# EAGLE design pdivider (EAGLE 9.6.2)
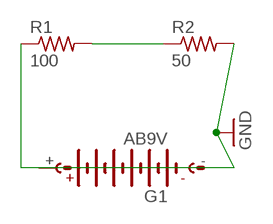
[diagram p0: schematic, sheet 1]

## Parts
G1  AB9V  [AB9V]
R1  100  R-US_R0603  [R0603]
R2  50  R-US_R0603  [R0603]

## Nets
GND: G1.+ R2.2
N$1: G1.- R1.1
N$2: R1.2 R2.1

## Library data of the parts
G1 = battery:AB9V: 9-V BATTERY CLIP
R1 R2 = rcl:R-US_: RESISTOR, American symbol; SPICEPREFIX: R

## Board
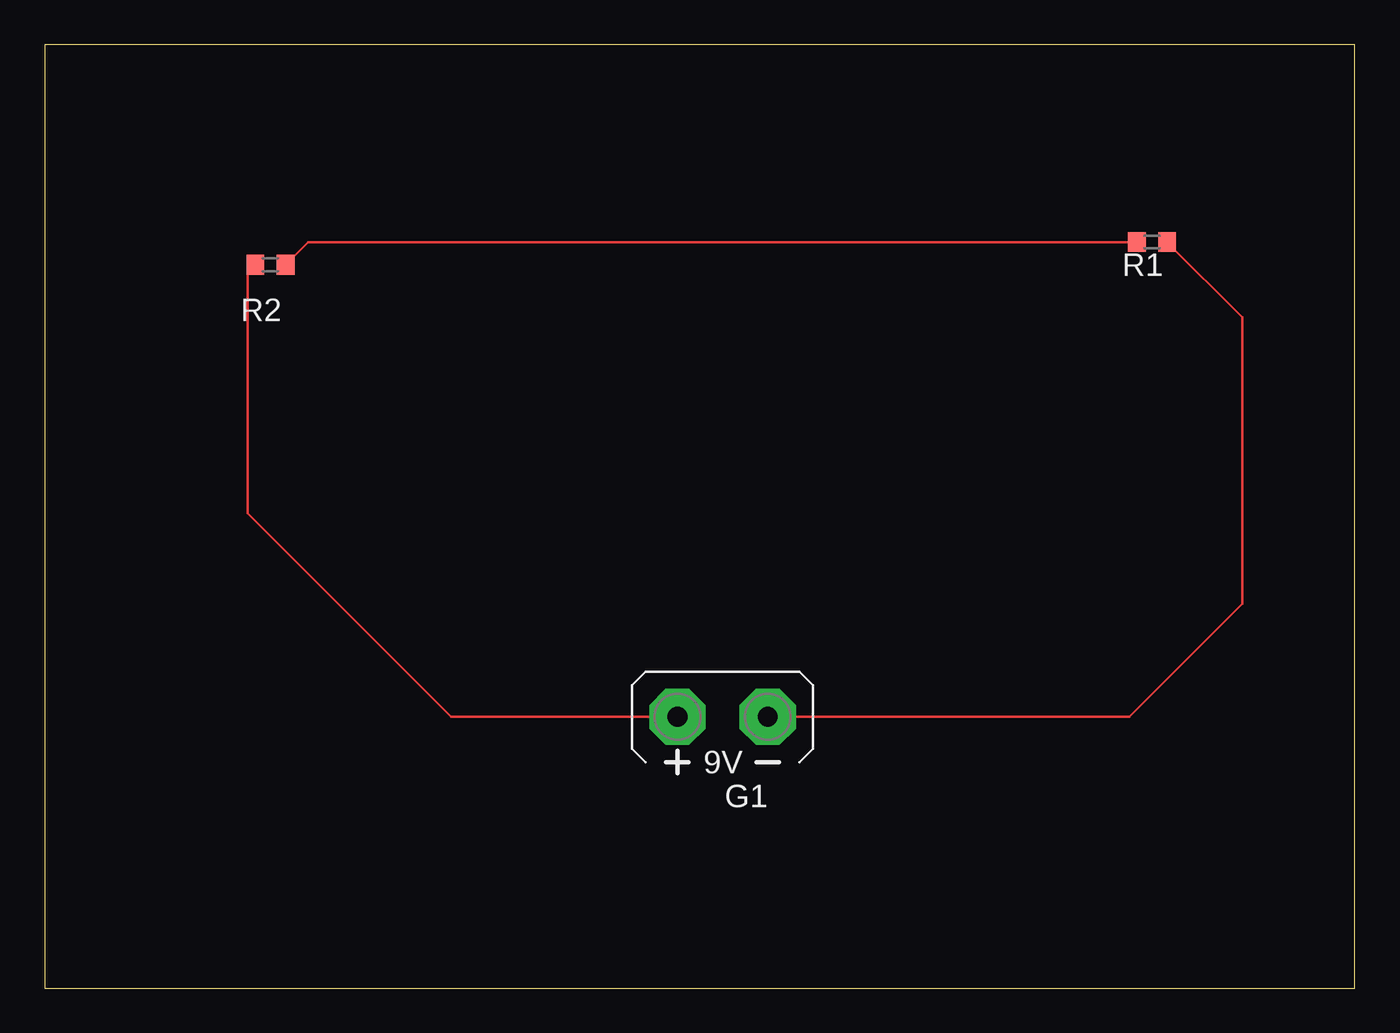
[diagram p1: board, top side]

Size 73.64 x 53.01 mm. Coordinates in mm from the lower left corner, seen from the top.
Outline: 0,0 73.64,0 73.64,53.01 0,53.01 0,0
Copper layers (1*16): Top 0.035mm / dielectric 1.5mm / Bottom 0.035mm
Design rules "default": minimum track width 6mil, minimum drill 0.35mm, track to track 6mil, track to pad 6mil, pad to pad 6mil, via to via 6mil, smd to smd 6mil, copper to edge 40mil, drill to drill 6mil, minimum pad ring 10mil, minimum via ring 8mil, stop-mask expansion 4mil, vias tented up to drill 0mil, thermal gap 10mil

### Footprints (pad centres in the part's own frame; a part is rotated, then mirrored left to right if it is on the bottom)
AB9V = drill 1.118 pad 3.15 octagon: + 0,2.54; - 0,-2.54
R0603 = smd 1 x 1.1: 1 -0.85,0; 2 0.85,0

### Placement (x,y rotation side)
G1  38.1,15.24 90 top
R1  62.23,41.91 180 top
R2  12.7,40.64 180 top

### Tracks (layer width: path | path; a pad name or v marks a point on that pad's centre or on a via)
GND
  Top 0.152: G1.+ 22.86,15.24 11.43,26.67 11.43,40.22 R2.2
N$1
  Top 0.152: R1.1 67.31,37.68 67.31,21.59 60.96,15.24 43.18,15.24 41.91,15.24 G1.-
N$2
  Top 0.152: R2.1 14.82,41.91 R1.2